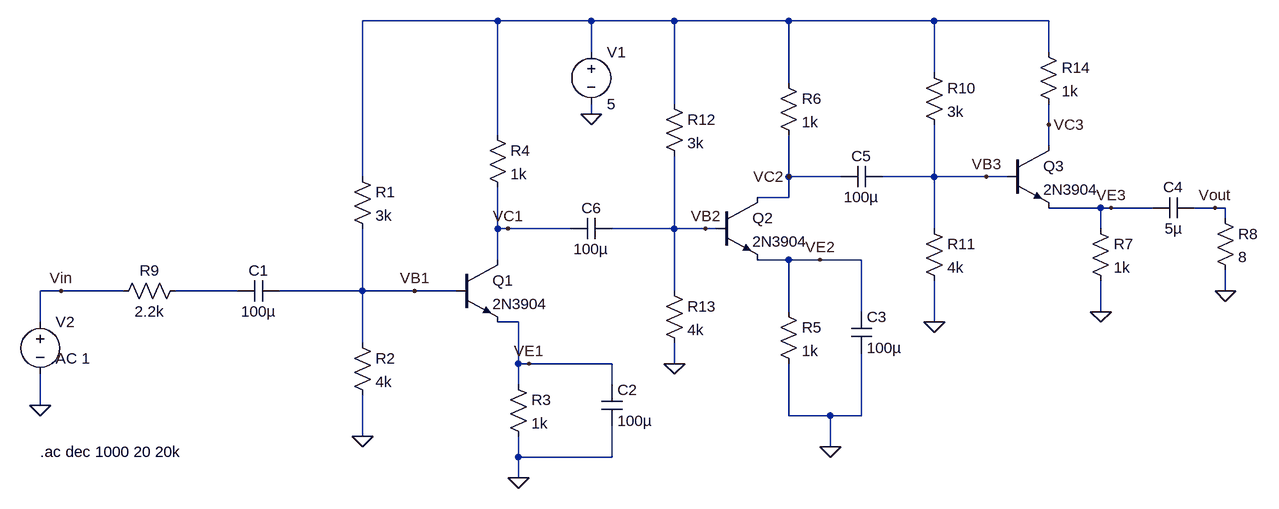
[diagram p0: schematic 40dB Analogue Amplifier.asc]
40dB Analogue Amplifier.asc, the LTspice schematic file:
Version 4.1
SHEET 1 1860 680
WIRE 464 -176 256 -176
WIRE 608 -176 464 -176
WIRE 736 -176 608 -176
WIRE 912 -176 736 -176
WIRE 1136 -176 912 -176
WIRE 1312 -176 1136 -176
WIRE 608 -128 608 -176
WIRE 1312 -128 1312 -176
WIRE 1136 -96 1136 -176
WIRE 912 -80 912 -176
WIRE 736 -48 736 -176
WIRE 608 -32 608 -48
WIRE 1312 -16 1312 -48
WIRE 464 0 464 -176
WIRE 1312 16 1312 -16
WIRE 256 64 256 -176
WIRE 912 64 912 0
WIRE 992 64 912 64
WIRE 1136 64 1136 -16
WIRE 1136 64 1056 64
WIRE 1216 64 1136 64
WIRE 1248 64 1216 64
WIRE 912 96 912 64
WIRE 912 96 864 96
WIRE 1392 112 1312 112
WIRE 1408 112 1392 112
WIRE 1472 112 1408 112
WIRE 1568 112 1536 112
WIRE 1584 112 1568 112
WIRE 1584 128 1584 112
WIRE 464 144 464 80
WIRE 480 144 464 144
WIRE 576 144 480 144
WIRE 736 144 736 32
WIRE 736 144 640 144
WIRE 784 144 736 144
WIRE 800 144 784 144
WIRE 1136 144 1136 64
WIRE 1392 144 1392 112
WIRE 464 192 464 144
WIRE 912 192 864 192
WIRE 960 192 912 192
WIRE 1024 192 960 192
WIRE -208 240 -240 240
WIRE -112 240 -208 240
WIRE 64 240 -32 240
WIRE 256 240 256 144
WIRE 256 240 128 240
WIRE 336 240 256 240
WIRE 400 240 336 240
WIRE 736 240 736 144
WIRE 1584 240 1584 208
WIRE 912 272 912 192
WIRE 1024 272 1024 192
WIRE 1392 272 1392 224
WIRE -240 288 -240 240
WIRE 496 288 464 288
WIRE 1136 288 1136 224
WIRE 256 320 256 240
WIRE 496 352 496 288
WIRE 512 352 496 352
WIRE 640 352 512 352
WIRE 736 352 736 320
WIRE 496 384 496 352
WIRE 640 384 640 352
WIRE -240 416 -240 368
WIRE 912 432 912 352
WIRE 976 432 912 432
WIRE 1024 432 1024 336
WIRE 1024 432 976 432
WIRE 256 464 256 400
WIRE 976 480 976 432
WIRE 496 496 496 464
WIRE 640 496 640 448
WIRE 640 496 496 496
WIRE 496 528 496 496
FLAG 496 528 0
FLAG 256 464 0
FLAG 608 -32 0
FLAG -240 416 0
FLAG -208 240 Vin
FLAG 976 480 0
FLAG 1584 240 0
FLAG 1392 272 0
FLAG 1568 112 Vout
FLAG 1136 288 0
FLAG 736 352 0
FLAG 336 240 VB1
FLAG 784 144 VB2
FLAG 1216 64 VB3
FLAG 512 352 VE1
FLAG 960 192 VE2
FLAG 1408 112 VE3
FLAG 480 144 VC1
FLAG 912 64 VC2
FLAG 1312 -16 VC3
SYMBOL npn 400 192 R0
SYMATTR InstName Q1
SYMATTR Value 2N3904
SYMBOL res 240 48 R0
SYMATTR InstName R1
SYMATTR Value 3k
SYMBOL res 240 304 R0
SYMATTR InstName R2
SYMATTR Value 4k
SYMBOL cap 128 224 R90
WINDOW 0 0 32 VBottom 2
WINDOW 3 32 32 VTop 2
SYMATTR InstName C1
SYMATTR Value 100µ
SYMBOL res 480 368 R0
SYMATTR InstName R3
SYMATTR Value 1k
SYMBOL cap 624 384 R0
SYMATTR InstName C2
SYMATTR Value 100µ
SYMBOL res 448 -16 R0
SYMATTR InstName R4
SYMATTR Value 1k
SYMBOL voltage 608 -144 R0
WINDOW 123 0 0 Left 0
WINDOW 39 0 0 Left 0
SYMATTR InstName V1
SYMATTR Value 5
SYMBOL voltage -240 272 R0
WINDOW 123 24 72 Left 2
WINDOW 39 0 0 Left 0
WINDOW 3 24 44 Left 2
SYMATTR Value2 AC 1
SYMATTR InstName V2
SYMATTR Value ""
SYMBOL npn 800 96 R0
SYMATTR InstName Q2
SYMATTR Value 2N3904
SYMBOL res 896 256 R0
SYMATTR InstName R5
SYMATTR Value 1k
SYMBOL cap 1008 272 R0
SYMATTR InstName C3
SYMATTR Value 100µ
SYMBOL res 896 -96 R0
SYMATTR InstName R6
SYMATTR Value 1k
SYMBOL npn 1248 16 R0
SYMATTR InstName Q3
SYMATTR Value 2N3904
SYMBOL res 1568 112 R0
SYMATTR InstName R8
SYMATTR Value 8
SYMBOL cap 1536 96 R90
WINDOW 0 0 32 VBottom 2
WINDOW 3 32 32 VTop 2
SYMATTR InstName C4
SYMATTR Value 5µ
SYMBOL res 1376 128 R0
SYMATTR InstName R7
SYMATTR Value 1k
SYMBOL res -16 224 R90
WINDOW 0 0 56 VBottom 2
WINDOW 3 32 56 VTop 2
SYMATTR InstName R9
SYMATTR Value 2.2k
SYMBOL res 1120 -112 R0
SYMATTR InstName R10
SYMATTR Value 3k
SYMBOL res 1120 128 R0
SYMATTR InstName R11
SYMATTR Value 4k
SYMBOL cap 1056 48 R90
WINDOW 0 0 32 VBottom 2
WINDOW 3 32 32 VTop 2
SYMATTR InstName C5
SYMATTR Value 100µ
SYMBOL res 720 -64 R0
SYMATTR InstName R12
SYMATTR Value 3k
SYMBOL res 720 224 R0
SYMATTR InstName R13
SYMATTR Value 4k
SYMBOL cap 640 128 R90
WINDOW 0 0 32 VBottom 2
WINDOW 3 32 32 VTop 2
SYMATTR InstName C6
SYMATTR Value 100µ
SYMBOL res 1296 -144 R0
SYMATTR InstName R14
SYMATTR Value 1k
TEXT -240 488 Left 2 !.ac dec 1000 20 20k

The netlist it stands for:
* 40dB Analogue Amplifier.asc
Q1 VC1 VB1 VE1 0 2N3904
R1 N001 VB1 3k
R2 VB1 0 4k
C1 VB1 N002 100µ
R3 VE1 0 1k
C2 VE1 0 100µ
R4 N001 VC1 1k
V1 N001 0 5
V2 Vin 0 AC 1
Q2 VC2 VB2 VE2 0 2N3904
R5 VE2 0 1k
C3 VE2 0 100µ
R6 N001 VC2 1k
Q3 VC3 VB3 VE3 0 2N3904
R8 Vout 0 8
C4 Vout VE3 5µ
R7 VE3 0 1k
R9 N002 Vin 2.2k
R10 N001 VB3 3k
R11 VB3 0 4k
C5 VB3 VC2 100µ
R12 N001 VB2 3k
R13 VB2 0 4k
C6 VB2 VC1 100µ
R14 N001 VC3 1k
.model NPN NPN
.model PNP PNP
.lib standard.bjt
.ac dec 1000 20 20k
.backanno
.end